# Altium project PHANTOM_VCU.PrjPcb (part 2 of 4)

## Sheet Power_MCU.SchDoc
size A4; DocumentNumber: 3; SheetNumber: 3; SheetTotal: 8
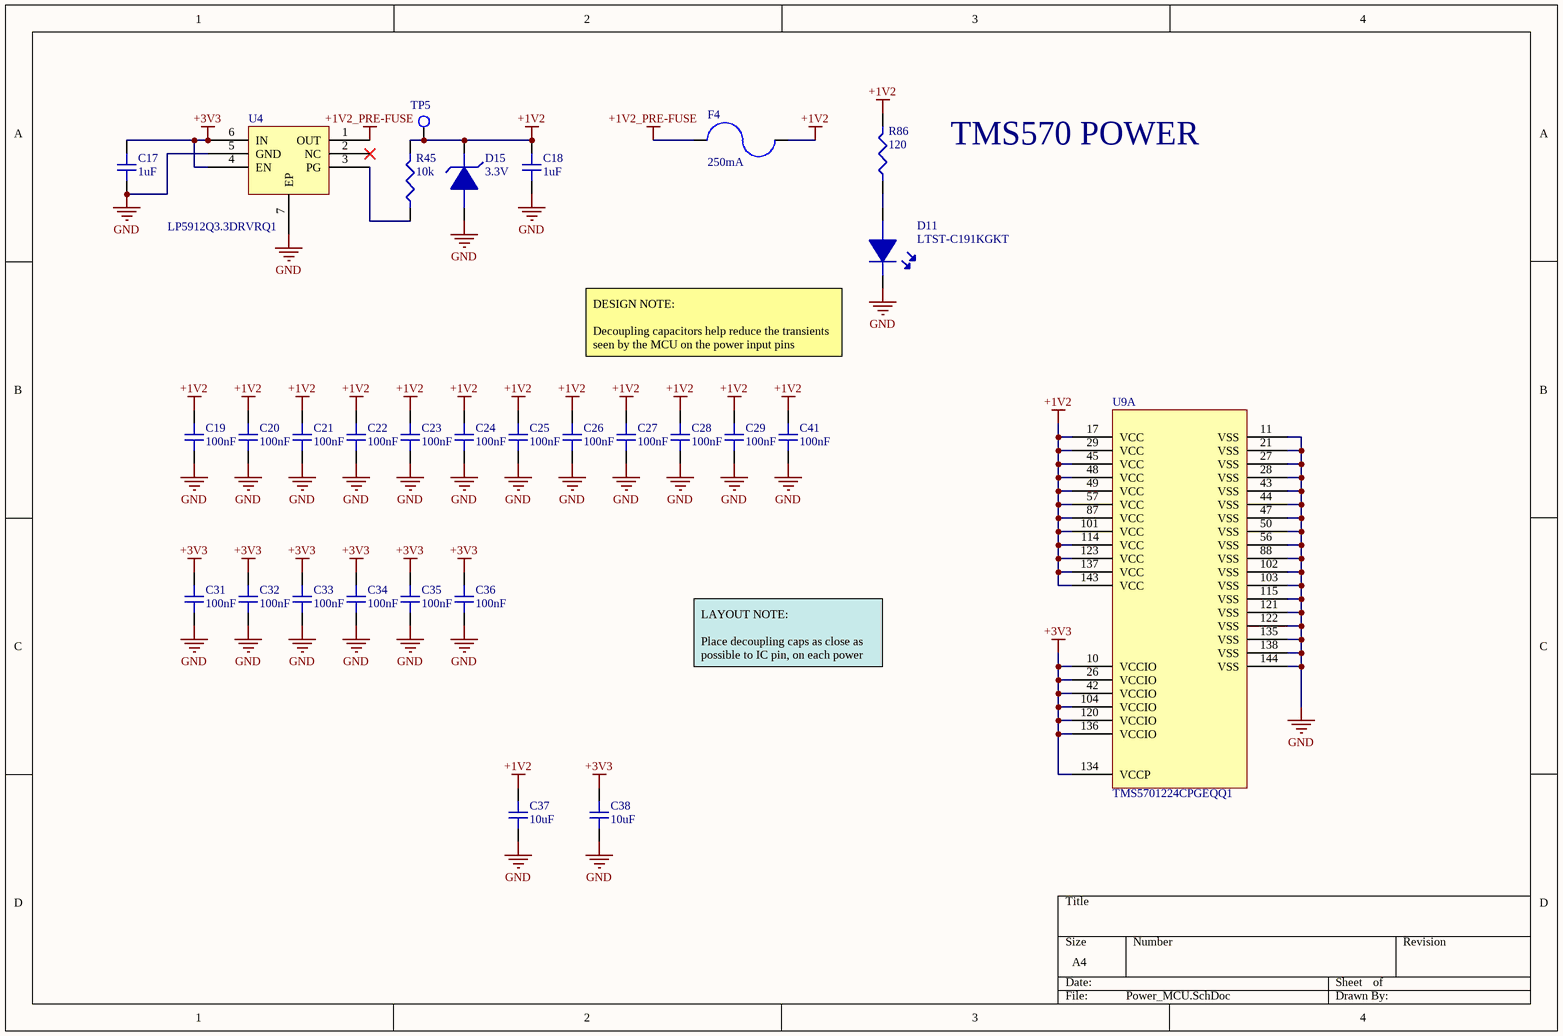
[diagram p2: Power_MCU.SchDoc]

### Parts
C17  1uF  [C0805]
C18  1uF  [C0805]
C19  100nF  [C0805]
C20  100nF  [C0805]
C21  100nF  [C0805]
C22  100nF  [C0805]
C23  100nF  [C0805]
C24  100nF  [C0805]
C25  100nF  [C0805]
C26  100nF  [C0805]
C27  100nF  [C0805]
C28  100nF  [C0805]
C29  100nF  [C0805]
C31  100nF  [C0805]
C32  100nF  [C0805]
C33  100nF  [C0805]
C34  100nF  [C0805]
C35  100nF  [C0805]
C36  100nF  [C0805]
C37  10uF  [TANT_10u]
C38  10uF  [TANT_10u]
C41  100nF  [C0805]
D11  LTST-C191KGKT  [LED_0603]
D15  3.3V  [DIODE_TVS]
F4  250mA  [FUSE_0603]
R45  10k  [R0805]
R86  120  [R0805]
TP5  5015  [TP_HOOK]  (value not drawn)
U4  LP5912Q3.3DRVRQ1  [WSON]
U9  TMS5701224CPGEQQ1  [LQFP-144]  (part A of 3)

### Nets
+1V2: C18.2 C19.2 C20.2 C21.2 C22.2 C23.2 C24.2 C25.2 C26.2 C27.2 C28.2 C29.2 C37.1 C41.2 D15.1 F4.2 R45.2 R86.2 TP5.1 U9.17(VCC) U9.29(VCC) U9.45(VCC) U9.48(VCC) U9.49(VCC) U9.57(VCC) U9.87(VCC) U9.101(VCC) U9.114(VCC) U9.123(VCC) U9.137(VCC) U9.143(VCC)
+1V2_PRE-FUSE: F4.1 U4.1(OUT)
+3V3: C17.2 C31.2 C32.2 C33.2 C34.2 C35.2 C36.2 C38.1 U4.4(EN) U4.6(IN) U9.10(VCCIO) U9.26(VCCIO) U9.42(VCCIO) U9.104(VCCIO) U9.120(VCCIO) U9.134(VCCP) U9.136(VCCIO)
GND: C17.1 C18.1 C19.1 C20.1 C21.1 C22.1 C23.1 C24.1 C25.1 C26.1 C27.1 C28.1 C29.1 C31.1 C32.1 C33.1 C34.1 C35.1 C36.1 C37.2 C38.2 C41.1 D11.2 D15.2 U4.5(GND) U4.7(EP) U9.11(VSS) U9.21(VSS) U9.27(VSS) U9.28(VSS) U9.43(VSS) U9.44(VSS) U9.47(VSS) U9.50(VSS) U9.56(VSS) U9.88(VSS) U9.102(VSS) U9.103(VSS) U9.115(VSS) U9.121(VSS) U9.122(VSS) U9.135(VSS) U9.138(VSS) U9.144(VSS)
NetD11_1: D11.1 R86.1
NetR45_1: R45.1 U4.3(PG)

Not connected (* = marked no-connect by the designer): U4 2(NC)*

### Notes on the sheet
- TMS570 POWER
- DESIGN NOTE:
  Decoupling capacitors help reduce the transients seen by the MCU on the power input pins
- LAYOUT NOTE:
  Place decoupling caps as close as possible to IC pin, on each power pin

### Library data of the parts
C17 C18 = 0805ZC105KAT2A: CAP CER 1UF 10V X7R 0805; Manufacturer: Kyocera AVX; Tolerance: 10%; Dissipation Factor: 5%; Insulation Resistance: 100GR; Supplier 1: Digi-Key; Manufacturer Part Number: 0805ZC105KAT2A; Stock 1: 385183; Pricing 1: 1=0.21, 10=0.147, 100=0.069, 500=0.0484, 1000=0.0401 (USD); Mount: Surface Mount,PCB; Case/Package: 0805; Number of Pins: 2; Case Code (Imperial): 0805; Case Code (Metric): 2012; Contact Plating: Tin,Matte; Min Operating Temperature: -55°C; Max Operating Temperature: 125°C; Capacitance: 1uF; Voltage Rating: 10V; Voltage Rating (DC): 10V; Packaging: Tape and Reel; Package Quantity: 1; Dielectric: X7R; Termination: SMD/SMT; Voltage: 10V; Length: 2.01mm; Height: 1.4mm; Width: 1.25mm; Thickness: 0.055inch; Depth: 1.25mm; Radiation Hardening: No; REACH SVHC: No SVHC; Lead Free: Lead Free; ComponentLink1URL: https://datasheet.ciiva.com/2988/cx7r-2988071.pdf; ComponentLink1Description: https://datasheet.ciiva.com/2988/cx7r-2988071.pdf; ComponentLink2URL: https://datasheet.ciiva.com/2988/cx7r-2988072.pdf; ComponentLink2Description: https://datasheet.ciiva.com/2988/cx7r-2988072.pdf; ComponentLink3URL: https://datasheet.ciiva.com/14601/70001075-14601048.pdf; ComponentLink3Description: https://datasheet.ciiva.com/14601/70001075-14601048.pdf; ComponentLink4URL: https://datasheet.ciiva.com/14594/70001075-14594329.pdf; ComponentLink4Description: https://datasheet.ciiva.com/14594/70001075-14594329.pdf; ComponentLink5URL: https://datasheet.ciiva.com/25901/cx7r-25901193.pdf; ComponentLink5Description: https://datasheet.ciiva.com/25901/cx7r-25901193.pdf; ComponentLink6URL: https://datasheet.ciiva.com/15165/getdatasheetpartid-71567-15165451.pdf; ComponentLink6Description: https://datasheet.ciiva.com/15165/getdatasheetpartid-71567-15165451.pdf; ComponentLink7URL: https://datasheet.ciiva.com/151/cx7r-151916.pdf; ComponentLink7Description: https://datasheet.ciiva.com/151/cx7r-151916.pdf; ComponentLink8URL: https://datasheet.ciiva.com/151/cx7r-151917.pdf; ComponentLink8Description: https://datasheet.ciiva.com/151/cx7r-151917.pdf; ComponentLink9URL: https://datasheet.ciiva.com/151/cx7r-151918.pdf; ComponentLink9Description: https://datasheet.ciiva.com/151/cx7r-151918.pdf; ComponentLink10URL: https://datasheet.ciiva.com/11787/0900766b80ed4be2-11787102.pdf; ComponentLink10Description: https://datasheet.ciiva.com/11787/0900766b80ed4be2-11787102.pdf; ComponentLink11URL: https://datasheet.ciiva.com/7812/84526-7812223.pdf; ComponentLink11Description: https://datasheet.ciiva.com/7812/84526-7812223.pdf; ComponentLink12URL: https://datasheet.ciiva.com/19475/2011248-19475855.pdf; ComponentLink12Description: https://datasheet.ciiva.com/19475/2011248-19475855.pdf; Supplier Part Number 1: 478-1405-1-ND
C19-C29 C31-C36 C41 = GRM21B7U1A104JA01L: CAP MLCC 100nF 10Volts U2J 5%; Manufacturer: Murata; Voltage Rating: 10V; Supplier 1: Digi-Key; Manufacturer Part Number: GRM21B7U1A104JA01L; Stock 1: 6000; Pricing 1: 1=0.46, 10=0.32, 100=0.192, 500=0.144, 1000=0.1216 (USD); Mount: Surface Mount; Case/Package: 0805; Case Code (Imperial): 0805; Case Code (Metric): 2012; Min Operating Temperature: -55°C; Max Operating Temperature: 125°C; Capacitance: 100nF; Voltage Rating (DC): 10V; Tolerance: 5%; Packaging: Tape and Reel; Package Quantity: 3000; Dielectric: U2J; Termination: SMD/SMT; Length: 2mm; Height: 1.25mm; Width: 0.049inch; Thickness: 0.053inch; Depth: 1.25mm; Radiation Hardening: No; ComponentLink1URL: https://datasheet.ciiva.com/5424/product-5424660.pdf; ComponentLink1Description: https://datasheet.ciiva.com/5424/product-5424660.pdf; ComponentLink2URL: https://datasheet.ciiva.com/17451/product-17451845.pdf; ComponentLink2Description: https://datasheet.ciiva.com/17451/product-17451845.pdf; ComponentLink3URL: https://datasheet.ciiva.com/11618/product-11618924.pdf; ComponentLink3Description: https://datasheet.ciiva.com/11618/product-11618924.pdf; Supplier Part Number 1: 490-11592-6-ND
C37 C38 = F381A106MMA: CAP TANTALUM 10uF, 0603 [1608 Metric], 0.5 ohm, 10 V AVX  Surface Mount Tantalum Capacitor, F38 Series, 10uF, 0603 [1608 Metric], 0.5 ohm, 10 V; Manufacturer: Kyocera AVX; Tolerance: 20%; ESR (Equivalent Series Resistance): 500mR; Voltage Rating: 10V; Life (Hours): 1000Hour; Dissipation Factor: 15%; Leakage Current: 10uA; Supplier 1: Digi-Key; Manufacturer Part Number: F381A106MMA; Stock 1: 7989; Pricing 1: 1=0.75, 10=0.551, 100=0.3779, 500=0.2992, 1000=0.2519 (USD); Case/Package: 0603; Weight: 7.1E-05oz; Case Code (Metric): 1608; Case Code (Imperial): 0603; Min Operating Temperature: -55°C; Max Operating Temperature: 105°C; Capacitance: 10uF; Packaging: Tape and Reel; Termination: SMD/SMT; Package Quantity: 4000; Voltage Rating (DC): 10V; Length: 1.6mm; Height: 0.8mm; Width: 0.033inch; Height - Seated (Max): 0.035inch; Depth: 0.85mm; Radiation Hardening: No; REACH SVHC: No SVHC; ComponentLink1URL: https://datasheet.ciiva.com/48510/f38-48510901.pdf; ComponentLink1Description: https://datasheet.ciiva.com/48510/f38-48510901.pdf; ComponentLink2URL: https://datasheet.ciiva.com/46417/1805432-46417517.pdf; ComponentLink2Description: https://datasheet.ciiva.com/46417/1805432-46417517.pdf; ComponentLink3URL: https://datasheet.ciiva.com/46417/1805432-46417518.pdf; ComponentLink3Description: https://datasheet.ciiva.com/46417/1805432-46417518.pdf; Supplier Part Number 1: 478-9527-1-ND
D11 = LTST-C191KGKT: LED GREEN CLEAR 0603 SMD; Manufacturer: Vishay Lite-On; Lens Colour: Clear,Colorless; Power Rating: 75mW; Luminous Intensity: 35mcd; Viewing Angle: 130°; Lens Style: Clear,Diffused,Colorless,Rectangular; Forward Current: 30mA; Forward Voltage: 2V; Dominant Wavelength: 571nm; Test Current: 20mA; Number of Elements: 1; Wavelength: 574nm; Supplier 1: Digi-Key; Manufacturer Part Number: LTST-C191KGKT; Stock 1: 1301664; Pricing 1: 1=0.29, 10=0.211, 25=0.1556, 100=0.1111, 250=0.0756, 500=0.0667, 1000=0.0522, 2500=0.0511 (USD); Mount: Surface Mount; Case/Package: 0603; Number of Pins: 2; Colour: Green; Case Code (Metric): 1608; Case Code (Imperial): 0603; Min Operating Temperature: -55°C; Max Operating Temperature: 85°C; Packaging: Tape and Reel; Package Quantity: 1; Illumination Colour: Green; Lens Transparency: Clear; Power Dissipation: 75mW; Number of LEDs: 1; Length: 1.6mm; Height: 0.55mm; Width: 0.8mm; Depth: 0.8mm; Radiation Hardening: No; Lead Free: Lead Free; ComponentLink1URL: https://datasheet.ciiva.com/12400/100-ltst-c191kgkt-53586-12400818.pdf; ComponentLink1Description: https://datasheet.ciiva.com/12400/100-ltst-c191kgkt-53586-12400818.pdf; ComponentLink2URL: https://datasheet.ciiva.com/2109/s-110-ltst-c191kgkt-2109973.pdf; ComponentLink2Description: https://datasheet.ciiva.com/2109/s-110-ltst-c191kgkt-2109973.pdf; ComponentLink3URL: https://datasheet.ciiva.com/2109/s-110-ltst-c191kgkt-2109974.pdf; ComponentLink3Description: https://datasheet.ciiva.com/2109/s-110-ltst-c191kgkt-2109974.pdf; ComponentLink4URL: https://datasheet.ciiva.com/2109/s-110-ltst-c191kgkt-2109975.pdf; ComponentLink4Description: https://datasheet.ciiva.com/2109/s-110-ltst-c191kgkt-2109975.pdf; ComponentLink5URL: https://datasheet.ciiva.com/15223/getdatasheetpartid-103913-15223276.pdf; ComponentLink5Description: https://datasheet.ciiva.com/15223/getdatasheetpartid-103913-15223276.pdf; ComponentLink6URL: https://datasheet.ciiva.com/11773/0900766b80dc02b1-11773629.pdf; ComponentLink6Description: https://datasheet.ciiva.com/11773/0900766b80dc02b1-11773629.pdf; ComponentLink7URL: https://datasheet.ciiva.com/16215/ltst-c191kgkt-16215151.pdf; ComponentLink7Description: https://datasheet.ciiva.com/16215/ltst-c191kgkt-16215151.pdf; Supplier Part Number 1: 160-1446-6-ND
D15 = 1SMA5913BT3G: DIODE ZENER 3.3V 1.5W SMA; Manufacturer: ON Semiconductor; Material: Plastic; Forward Voltage: 1.5V; Tolerance: 5%; Impedance: 10R; Max Reverse Leakage Current: 50uA; Power Dissipation: 500mW; Zener Current: 455mA; Test Current: 113.6mA; Element Configuration: Single; Breakdown Voltage: 3.47V; Supplier 1: Digi-Key; Manufacturer Part Number: 1SMA5913BT3G; Stock 1: 12228; Pricing 1: 1=0.38, 10=0.305, 100=0.2076, 500=0.1557, 1000=0.1168 (USD); Case/Package: SMA; Number of Pins: 2; Min Operating Temperature: -65°C; Max Operating Temperature: 150°C; Max Power Dissipation: 1.5W; Package Quantity: 1; Packaging: Tape and Reel; Zener Voltage: 3.3V; Voltage Tolerance: 5%; Working Voltage: 3.3V; Peak Reverse Current: 50uA; Voltage Rating (DC): 3.3V; Power Rating: 1.5W; Length: 4.57mm; Height: 2.05mm; Width: 2.92mm; Radiation Hardening: No; REACH SVHC: No SVHC; Lead Free: Lead Free; Halogen Free: Halogen Free; ComponentLink1URL: https://datasheet.ciiva.com/8026/1sma5913bt3-d-8026917.pdf; ComponentLink1Description: https://datasheet.ciiva.com/8026/1sma5913bt3-d-8026917.pdf; ComponentLink2URL: https://datasheet.ciiva.com/8345/1sma5913bt3-d-8345864.pdf; ComponentLink2Description: https://datasheet.ciiva.com/8345/1sma5913bt3-d-8345864.pdf; ComponentLink3URL: https://datasheet.ciiva.com/8346/1sma5913bt3-d-8346488.pdf; ComponentLink3Description: https://datasheet.ciiva.com/8346/1sma5913bt3-d-8346488.pdf; ComponentLink4URL: https://datasheet.ciiva.com/895/1sma5913bt3-d-895306.pdf; ComponentLink4Description: https://datasheet.ciiva.com/895/1sma5913bt3-d-895306.pdf; ComponentLink5URL: https://datasheet.ciiva.com/15142/getdatasheetpartid-90498-15142554.pdf; ComponentLink5Description: https://datasheet.ciiva.com/15142/getdatasheetpartid-90498-15142554.pdf; ComponentLink6URL: https://datasheet.ciiva.com/895/1sma5913bt3-d-895307.pdf; ComponentLink6Description: https://datasheet.ciiva.com/895/1sma5913bt3-d-895307.pdf; ComponentLink7URL: https://datasheet.ciiva.com/4733/1sma5913bt3-d-4733195.pdf; ComponentLink7Description: https://datasheet.ciiva.com/4733/1sma5913bt3-d-4733195.pdf; ComponentLink8URL: https://datasheet.ciiva.com/895/1sma5913bt3-d-895308.pdf; ComponentLink8Description: https://datasheet.ciiva.com/895/1sma5913bt3-d-895308.pdf; ComponentLink9URL: https://datasheet.ciiva.com/16472/1sma5913bt3-d-16472764.pdf; ComponentLink9Description: https://datasheet.ciiva.com/16472/1sma5913bt3-d-16472764.pdf; ComponentLink10URL: https://datasheet.ciiva.com/49027/70339279-49027772.pdf; ComponentLink10Description: https://datasheet.ciiva.com/49027/70339279-49027772.pdf; ComponentLink11URL: https://datasheet.ciiva.com/8026/1sma5913bt3-d-8026989.pdf; ComponentLink11Description: https://datasheet.ciiva.com/8026/1sma5913bt3-d-8026989.pdf; ComponentLink12URL: https://datasheet.ciiva.com/8026/1sma5913bt3-d-8026990.pdf; ComponentLink12Description: https://datasheet.ciiva.com/8026/1sma5913bt3-d-8026990.pdf; ComponentLink13URL: https://datasheet.ciiva.com/26092/1sma5913bt3-d-26092398.pdf; ComponentLink13Description: https://datasheet.ciiva.com/26092/1sma5913bt3-d-26092398.pdf; Supplier Part Number 1: 1SMA5913BT3GOSCT-ND
F4 = C2Q250: FUSE_0.25A SMD 0603 BOARD MNT 250MA 32VAC 63VDC; Manufacturer: Bel; Voltage Rating (DC): 63V; Voltage Rating (AC): 32V; DC Cold Resistance: 700mR; Power Dissipation: 80mW; Fuse Type: Board Mount (Cartridge Style Excluded); Approvals: CE,cULus,cURus; Supplier 1: Digi-Key; Manufacturer Part Number: C2Q250; Stock 1: 88874; Pricing 1: 1=0.33, 5=0.322, 10=0.308, 50=0.2746, 100=0.2557, 250=0.2273, 500=0.1894, 1000=0.18 (USD); Mount: Surface Mount; Case/Package: 0603; Number of Pins: 2; Case Code (Metric): 1608; Case Code (Imperial): 0603; Contact Plating: Tin; Housing Material: Ceramic; Min Operating Temperature: -55°C; Max Operating Temperature: 125°C; Current Rating: 250mA; Packaging: Tape and Reel; Max Voltage Rating (DC): 63V; Voltage Rating: 32V; Length: 0.063inch; Height: 0.019inch; Width: 0.032inch; Depth: 0.82mm; Lead Free: Lead Free; ComponentLink1URL: https://datasheet.ciiva.com/300/c2q-300599.pdf; ComponentLink1Description: https://datasheet.ciiva.com/300/c2q-300599.pdf; ComponentLink2URL: https://datasheet.ciiva.com/300/c2q-300600.pdf; ComponentLink2Description: https://datasheet.ciiva.com/300/c2q-300600.pdf; ComponentLink3URL: https://datasheet.ciiva.com/300/c2q-300601.pdf; ComponentLink3Description: https://datasheet.ciiva.com/300/c2q-300601.pdf; ComponentLink4URL: https://datasheet.ciiva.com/8264/c2q-8264041.pdf; ComponentLink4Description: https://datasheet.ciiva.com/8264/c2q-8264041.pdf; Supplier Part Number 1: 507-1086-1-ND
R45 = RC0805FR-071KL: RES SMD 10K OHM 1% 1/8W 0805; Manufacturer: Yageo Phycomp; Temperature Coefficient: 100ppm/°C; Resistance: 1KR; Voltage Rating (DC): 150V; Power Rating: 125mW; Supplier 1: Digi-Key; Manufacturer Part Number: RC0805FR-071KL; Stock 1: 5527973; Pricing 1: 1=0.1, 10=0.022, 100=0.0088, 1000=0.004, 2500=0.0034 (USD); Case/Package: 0805; Number of Pins: 2; Min Operating Temperature: -55°C; Max Operating Temperature: 155°C; Tolerance: 1%; Packaging: Cut Tape; Length: 2mm; Height: 0.5mm; Width: 1.25mm; Depth: 1.25mm; REACH SVHC: No SVHC; Lead Free: Lead Free
R86 = RC0805FR-07120RL: RES SMD 120 OHM 1% 1/8W 0805; Manufacturer: Yageo; Resistance: 120R; Power Rating: 125mW; Voltage Rating: 150V; Temperature Coefficient: 100ppm/°C; Supplier 1: Digi-Key; Manufacturer Part Number: RC0805FR-07120RL; Stock 1: 632664; Pricing 1: 1=0.1, 10=0.022, 100=0.0088, 1000=0.004, 2500=0.0034 (USD); Case/Package: 0805; Case Code (Metric): 2012; Case Code (Imperial): 0805; Min Operating Temperature: -55°C; Max Operating Temperature: 155°C; Tolerance: 1%; Package Quantity: 1; Packaging: Tape and Reel; Composition: Thick Film; Number of Terminations: 2; Termination: SMD/SMT; Military Standard: Not; Max Power Dissipation: 125mW; Length: 2mm; Height: 0.5mm; Width: 0.049inch; Depth: 1.25mm; REACH SVHC: Unknown; Lead Free: Lead Free; ComponentLink1URL: https://datasheet.ciiva.com/2491/pyu-r-int-thick-7-2491585.pdf; ComponentLink1Description: https://datasheet.ciiva.com/2491/pyu-r-int-thick-7-2491585.pdf; ComponentLink2URL: https://datasheet.ciiva.com/2491/pyu-r-int-thick-7-2491586.pdf; ComponentLink2Description: https://datasheet.ciiva.com/2491/pyu-r-int-thick-7-2491586.pdf; ComponentLink3URL: https://datasheet.ciiva.com/2491/pyu-r-int-thick-7-2491587.pdf; ComponentLink3Description: https://datasheet.ciiva.com/2491/pyu-r-int-thick-7-2491587.pdf; ComponentLink4URL: https://datasheet.ciiva.com/12558/rc0805-257173-12558661.pdf; ComponentLink4Description: https://datasheet.ciiva.com/12558/rc0805-257173-12558661.pdf; ComponentLink5URL: https://datasheet.ciiva.com/11819/0900766b8106beab-11819786.pdf; ComponentLink5Description: https://datasheet.ciiva.com/11819/0900766b8106beab-11819786.pdf; ComponentLink6URL: https://datasheet.ciiva.com/7941/444164-7941691.pdf; ComponentLink6Description: https://datasheet.ciiva.com/7941/444164-7941691.pdf; ComponentLink7URL: https://datasheet.ciiva.com/7941/444164-7941692.pdf; ComponentLink7Description: https://datasheet.ciiva.com/7941/444164-7941692.pdf; ComponentLink8URL: https://datasheet.ciiva.com/16964/rc0805-16964606.pdf; ComponentLink8Description: https://datasheet.ciiva.com/16964/rc0805-16964606.pdf; Supplier Part Number 1: 311-120CRCT-ND
TP5 = 5015: TEST POINT, PCB, SMT; Manufacturer: Keystone Electronics; Number of Ports: 1; Supplier 1: Digi-Key; Manufacturer Part Number: 5015; Stock 1: 1937775; Pricing 1: 1=0.44, 10=0.421, 25=0.3604, 50=0.3064, 100=0.2944, 250=0.2644, 500=0.2524 (USD); Mount: Surface Mount; Colour: White; Contact Material: Bronze; Contact Plating: Tin,Silver,Lead; Material: Bronze,Silver; Package Quantity: 1; Packaging: Tape and Reel; Termination: Solder; Orientation: Straight; Length: 2.66mm; Height: 0.06inch; Thickness: 0.01inch; Depth: 1.01mm; REACH SVHC: No SVHC; Lead Free: Lead Free; ComponentLink1URL: https://datasheet.ciiva.com/2917/5015-2917616.pdf; ComponentLink1Description: https://datasheet.ciiva.com/2917/5015-2917616.pdf; ComponentLink2URL: https://datasheet.ciiva.com/2917/5015-2917617.pdf; ComponentLink2Description: https://datasheet.ciiva.com/2917/5015-2917617.pdf; ComponentLink3URL: https://datasheet.ciiva.com/1123/5015-1123862.pdf; ComponentLink3Description: https://datasheet.ciiva.com/1123/5015-1123862.pdf; ComponentLink4URL: https://datasheet.ciiva.com/16883/70182998-16883734.pdf; ComponentLink4Description: https://datasheet.ciiva.com/16883/70182998-16883734.pdf; Supplier Part Number 1: 36-5015CT-ND
U4 = LP5912Q3.3DRVRQ1: LDO_1V2 REG 3.3V INPUT 1V2 OUTPUT 0.5A; Manufacturer: Texas Instruments; Quiescent Current: 30uA; Dropout Voltage: 150mV; Supplier 1: Digi-Key; Manufacturer Part Number: LP5912Q3.3DRVRQ1; Stock 1: 10415; Pricing 1: 1=1.41, 10=1.261, 100=0.9831, 500=0.8122, 1000=0.6412 (USD); Min Operating Temperature: -40°C; Max Operating Temperature: 125°C; Lead Free: Lead Free; ComponentLink1URL: http://www.ti.com/lit/ds/symlink/lp5912-q1.pdf; ComponentLink1Description: http://www.ti.com/lit/ds/symlink/lp5912-q1.pdf; Supplier Part Number 1: 296-44294-1-ND
U9 = TMS5701224CPGEQQ1: ARM CORTEX R4 LOCK STEP HERCULES MCU; Manufacturer: Texas Instruments; Frequency: 160MHz; Interface: I2C,SPI,CAN,UART,USART,LIN,SCI,EBI/EMI; Number of I/Os: 64; Oscillator Type: External; RAM Size: 192KB; Number of Timers/Counters: 2; Watchdog Timer: Yes; Memory Type: FLASH; Memory Size: 1.25MB; Density: 1310720B; Peripherals: POR,PWM,WDT,DMA; Supplier 1: Digi-Key; Manufacturer Part Number: TMS5701224CPGEQQ1; Stock 1: 113; Pricing 1: 1=22.12, 10=20.402, 100=17.4222, 500=15.8176 (USD); Case/Package: LQFP; Number of Pins: 144; Min Operating Temperature: -40°C; Max Operating Temperature: 125°C; Packaging: Tray; Number of Programmable I/O: 64; Max Frequency: 160MHz; Number of GPIO: 64; Core Architecture: ARM; Lead Free: Lead Free; ComponentLink1URL: http://www.ti.com/lit/pdf/spnu515; ComponentLink1Description: http://www.ti.com/lit/pdf/spnu515; ComponentLink2URL: http://www.ti.com/lit/gpn/tms570ls1224; ComponentLink2Description: http://www.ti.com/lit/gpn/tms570ls1224; ComponentLink3URL: http://www.ti.com/general/docs/lit/getliterature.tsp?genericPartNumber=TMS570LS1224&&fileType=pdf; ComponentLink3Description: http://www.ti.com/general/docs/lit/getliterature.tsp?genericPartNumber=TMS570LS1224&&fileType=pdf; Supplier Part Number 1: 296-47200-ND

## Sheet VCU_Schematic.SchDoc
size A4; DocumentNumber: 4; SheetNumber: 4; SheetTotal: 8
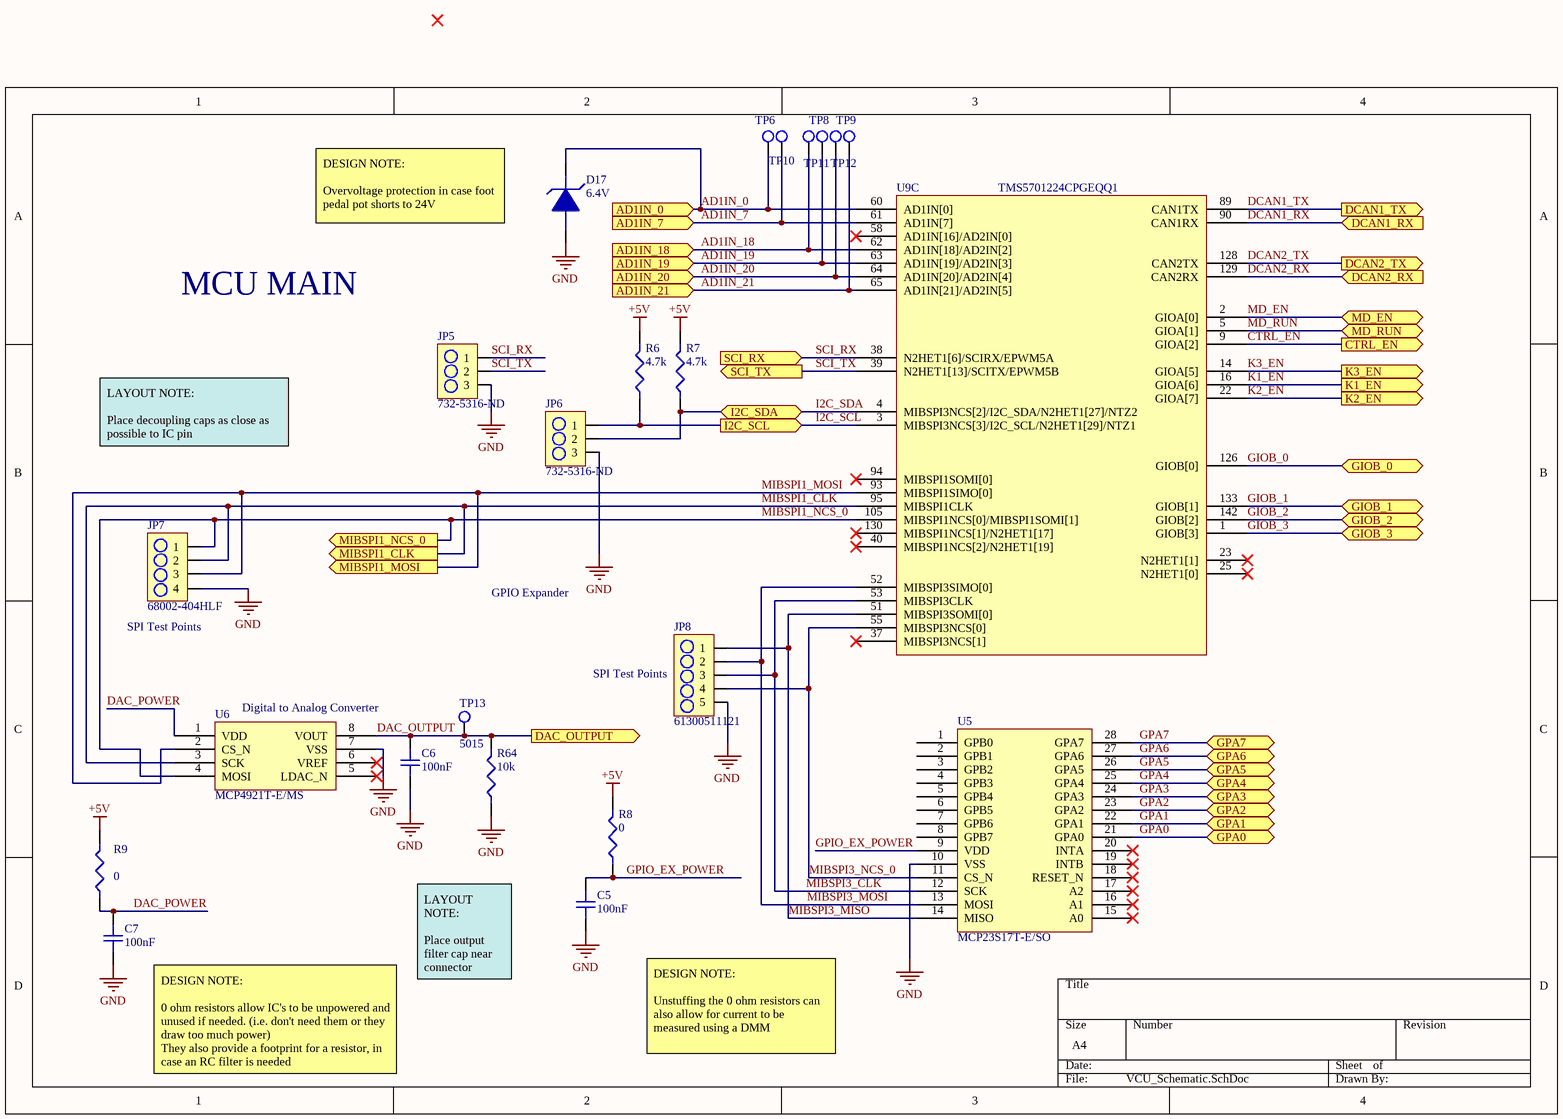
[diagram p3: VCU_Schematic.SchDoc]

### Parts
C5  100nF  [C0805]
C6  100nF  [C0805]
C7  100nF  [C0805]
D17  6.4V  [DIODE_TVS]
JP5  732-5316-ND  [3PIN_HEADER]
JP6  732-5316-ND  [3PIN_HEADER]
JP7  68002-404HLF  [4PIN_HEADER]
JP8  61300511121  [5PIN_HEADER]
R6  4.7k  [R0805]
R7  4.7k  [R0805]
R8  0  [R0805]
R9  0  [R0805]
R64  10k  [R0805]
TP6  5015  [TP_HOOK]  (value not drawn)
TP8  5015  [TP_HOOK]  (value not drawn)
TP9  5015  [TP_HOOK]  (value not drawn)
TP10  5015  [TP_HOOK]  (value not drawn)
TP11  5015  [TP_HOOK]  (value not drawn)
TP12  5015  [TP_HOOK]  (value not drawn)
TP13  5015  [TP_HOOK]
U5  MCP23S17T-E/SO  [28-SOIC_MCP23S17]
U6  MCP4921T-E/MS  [8-MSOP_MCP4921]
U9  TMS5701224CPGEQQ1  [LQFP-144]  (part C of 3)

### Ports
AD1IN_0, AD1IN_7, AD1IN_18, AD1IN_19, AD1IN_20, AD1IN_21, CTRL_EN, DAC_OUTPUT, DCAN1_RX, DCAN1_TX, DCAN2_RX, DCAN2_TX, GIOB_0, GIOB_1, GIOB_2, GIOB_3, GPA0, GPA1, GPA2, GPA3, GPA4, GPA5, GPA6, GPA7, I2C_SCL, I2C_SDA, K1_EN, K2_EN, K3_EN, MD_EN, MD_RUN, MIBSPI1_CLK, MIBSPI1_MOSI, MIBSPI1_NCS_0, SCI_RX, SCI_TX

### Nets
+5V: R6.2 R7.2 R8.2 R9.2
GND: C5.1 C6.1 C7.1 D17.2 JP5.3 JP6.3 JP7.4 JP8.5 R64.1 U5.10(VSS) U6.7(VSS)
AD1IN_0: D17.1 TP6.1 U9.60(AD1IN[0]) ; port AD1IN_0
AD1IN_7: TP10.1 U9.61(AD1IN[7]) ; port AD1IN_7
AD1IN_18: TP11.1 U9.62(AD1IN[18]/AD2IN[2]) ; port AD1IN_18
AD1IN_19: TP8.1 U9.63(AD1IN[19]/AD2IN[3]) ; port AD1IN_19
AD1IN_20: TP12.1 U9.64(AD1IN[20]/AD2IN[4]) ; port AD1IN_20
AD1IN_21: TP9.1 U9.65(AD1IN[21]/AD2IN[5]) ; port AD1IN_21
CTRL_EN: U9.9(GIOA[2]) ; port CTRL_EN
DAC_OUTPUT: C6.2 R64.2 TP13.1 U6.8(VOUT) ; port DAC_OUTPUT
DAC_POWER: C7.2 R9.1 U6.1(VDD)
DCAN1_RX: U9.90(CAN1RX) ; port DCAN1_RX
DCAN1_TX: U9.89(CAN1TX) ; port DCAN1_TX
DCAN2_RX: U9.129(CAN2RX) ; port DCAN2_RX
DCAN2_TX: U9.128(CAN2TX) ; port DCAN2_TX
GIOB_0: U9.126(GIOB[0]) ; port GIOB_0
GIOB_1: U9.133(GIOB[1]) ; port GIOB_1
GIOB_2: U9.142(GIOB[2]) ; port GIOB_2
GIOB_3: U9.1(GIOB[3]) ; port GIOB_3
GPA0: U5.21(GPA0) ; port GPA0
GPA1: U5.22(GPA1) ; port GPA1
GPA2: U5.23(GPA2) ; port GPA2
GPA3: U5.24(GPA3) ; port GPA3
GPA4: U5.25(GPA4) ; port GPA4
GPA5: U5.26(GPA5) ; port GPA5
GPA6: U5.27(GPA6) ; port GPA6
GPA7: U5.28(GPA7) ; port GPA7
GPIO_EX_POWER: C5.2 R8.1 U5.9(VDD)
I2C_SCL: JP6.1 R6.1 U9.3(MIBSPI3NCS[3]/I2C_SCL/N2HET1[29]/NTZ1) ; port I2C_SCL
I2C_SDA: JP6.2 R7.1 U9.4(MIBSPI3NCS[2]/I2C_SDA/N2HET1[27]/NTZ2) ; port I2C_SDA
K1_EN: U9.16(GIOA[6]) ; port K1_EN
K2_EN: U9.22(GIOA[7]) ; port K2_EN
K3_EN: U9.14(GIOA[5]) ; port K3_EN
MD_EN: U9.2(GIOA[0]) ; port MD_EN
MD_RUN: U9.5(GIOA[1]) ; port MD_RUN
MIBSPI1_CLK: JP7.2 U6.3(SCK) U9.95(MIBSPI1CLK) ; port MIBSPI1_CLK
MIBSPI1_MOSI: JP7.3 U6.2(CS_N) U9.93(MIBSPI1SIMO[0]) ; port MIBSPI1_MOSI
MIBSPI1_NCS_0: JP7.1 U6.4(MOSI) U9.105(MIBSPI1NCS[0]/MIBSPI1SOMI[1]) ; port MIBSPI1_NCS_0
MIBSPI3_CLK: JP8.3 U5.12(SCK) U9.53(MIBSPI3CLK)
MIBSPI3_MISO: JP8.1 U5.14(MISO) U9.51(MIBSPI3SOMI[0])
MIBSPI3_MOSI: JP8.2 U5.13(MOSI) U9.52(MIBSPI3SIMO[0])
MIBSPI3_NCS_0: JP8.4 U5.11(CS_N) U9.55(MIBSPI3NCS[0])
SCI_RX: JP5.1 U9.38(N2HET1[6]/SCIRX/EPWM5A) ; port SCI_RX
SCI_TX: JP5.2 U9.39(N2HET1[13]/SCITX/EPWM5B) ; port SCI_TX

Not connected (* = marked no-connect by the designer): U5 1(GPB0) 2(GPB1) 3(GPB2) 4(GPB3) 5(GPB4) 6(GPB5) 7(GPB6) 8(GPB7) 15(A0)* 16(A1)* 17(A2)* 18(RESET_N)* 19(INTB)* 20(INTA)*; U6 5(LDAC_N)* 6(VREF)*; U9 23(N2HET1[1])* 25(N2HET1[0])* 37(MIBSPI3NCS[1])* 40(MIBSPI1NCS[2]/N2HET1[19])* 58(AD1IN[16]/AD2IN[0])* 94(MIBSPI1SOMI[0])* 130(MIBSPI1NCS[1]/N2HET1[17])*

### Notes on the sheet
- DESIGN NOTE:
  Overvoltage protection in case foot pedal pot shorts to 24V
- MCU MAIN
- LAYOUT NOTE:
  Place decoupling caps as close as possible to IC pin
- GPIO Expander
- (near JP7) SPI Test Points
- Digital to Analog Converter
- (near JP8) SPI Test Points
- LAYOUT NOTE:
  Place output filter cap near connector
- (near C7) DESIGN NOTE:
  0 ohm resistors allow IC's to be unpowered and unused if needed. (i.e. don't need them or they draw too much power)
  They also provide a footprint for a resistor, in case an RC filter is needed
- DESIGN NOTE:
  Unstuffing the 0 ohm resistors can also allow for current to be measured using a DMM

### Library data of the parts
C5-C7 = GRM21B7U1A104JA01L: as C19 on sheet Power_MCU; Supplier 1: Digi-Key; Manufacturer Part Number: GRM21B7U1A104JA01L; Stock 1: 6000; Pricing 1: 1=0.46, 10=0.32, 100=0.192, 500=0.144, 1000=0.1216 (USD); Mount: Surface Mount; Case/Package: 0805; Case Code (Imperial): 0805; Case Code (Metric): 2012; Min Operating Temperature: -55°C; Max Operating Temperature: 125°C; Capacitance: 100nF; Voltage Rating (DC): 10V; Tolerance: 5%; Packaging: Tape and Reel; Package Quantity: 3000; Dielectric: U2J; Termination: SMD/SMT; Length: 2mm; Height: 1.25mm; Width: 0.049inch; Thickness: 0.053inch; Depth: 1.25mm; Radiation Hardening: No; ComponentLink1URL: https://datasheet.ciiva.com/5424/product-5424660.pdf; ComponentLink1Description: https://datasheet.ciiva.com/5424/product-5424660.pdf; ComponentLink2URL: https://datasheet.ciiva.com/17451/product-17451845.pdf; ComponentLink2Description: https://datasheet.ciiva.com/17451/product-17451845.pdf; ComponentLink3URL: https://datasheet.ciiva.com/11618/product-11618924.pdf; ComponentLink3Description: https://datasheet.ciiva.com/11618/product-11618924.pdf; Supplier Part Number 1: 490-11592-6-ND
D17 = SMAJ5.0A: DIODE TVS_6V4 5VWM 9.2VC SMA; Manufacturer: Littelfuse; Clamping Voltage: 9.2V; Polarity: Unidirectional; Power Dissipation: 400W; Voltage Rating (DC): 5V; Number of Elements: 1; Max Surge Current: 43.5A; Power Line Protection: No; Test Current: 10mA; Max Breakdown Voltage: 7V; Max Reverse Leakage Current: 800uA; Max Power Dissipation: 3.3W; Element Configuration: Single; Supplier 1: Digi-Key; Manufacturer Part Number: SMAJ5.0A; Stock 1: 78251; Pricing 1: 1=0.51, 10=0.359, 25=0.2948, 100=0.2359, 250=0.1716, 500=0.1394, 1000=0.1072, 2500=0.0965 (USD); Mount: Surface Mount; Number of Pins: 2; Min Operating Temperature: -65°C; Max Operating Temperature: 150°C; Direction: Unidirectional; Package Quantity: 5000; Operating Supply Voltage: 5V; Packaging: Tape and Reel; Reverse Breakdown Voltage: 6.4V; Number of Unidirectional Channels: 1; Reverse Standoff Voltage: 5V; Min Breakdown Voltage: 6.4V; Peak Pulse Power: 400W; Breakdown Voltage: 6.4V; Number of Channels: 1; Termination: SMD/SMT; Peak Pulse Current: 43.5A; Leakage Current: 800uA; Length: 4.5mm; Height: 2.087mm; Width: 2.79mm; Radiation Hardening: No; REACH SVHC: No SVHC; Lead Free: Lead Free; ComponentLink1URL: https://datasheet.ciiva.com/330/littelfuse-tvs-diode-smaj-datasheet-pdf-330724.pdf; ComponentLink1Description: https://datasheet.ciiva.com/330/littelfuse-tvs-diode-smaj-datasheet-pdf-330724.pdf; ComponentLink2URL: https://datasheet.ciiva.com/330/littelfuse-tvs-diode-smaj-datasheet-pdf-330725.pdf; ComponentLink2Description: https://datasheet.ciiva.com/330/littelfuse-tvs-diode-smaj-datasheet-pdf-330725.pdf; ComponentLink3URL: https://datasheet.ciiva.com/330/littelfuse-tvs-diode-smaj-datasheet-pdf-330726.pdf; ComponentLink3Description: https://datasheet.ciiva.com/330/littelfuse-tvs-diode-smaj-datasheet-pdf-330726.pdf; ComponentLink4URL: https://datasheet.ciiva.com/16380/littelfuse-tvs-diode-smaj-16380982.pdf; ComponentLink4Description: https://datasheet.ciiva.com/16380/littelfuse-tvs-diode-smaj-16380982.pdf; ComponentLink5URL: https://datasheet.ciiva.com/25624/0900766b810f4edb-25624839.pdf; ComponentLink5Description: https://datasheet.ciiva.com/25624/0900766b810f4edb-25624839.pdf; ComponentLink6URL: https://datasheet.ciiva.com/28473/607617-28473433.pdf; ComponentLink6Description: https://datasheet.ciiva.com/28473/607617-28473433.pdf; ComponentLink7URL: https://datasheet.ciiva.com/4507/littelfuse-tvs-diode-smaj-23503-4507964.pdf; ComponentLink7Description: https://datasheet.ciiva.com/4507/littelfuse-tvs-diode-smaj-23503-4507964.pdf; ComponentLink8URL: https://datasheet.ciiva.com/8062/littelfuse-tvs-diode-smaj-8062271.pdf; ComponentLink8Description: https://datasheet.ciiva.com/8062/littelfuse-tvs-diode-smaj-8062271.pdf; Supplier Part Number 1: SMAJ5.0ALFCT-ND
JP5 JP6 = 61300311121: CONN_HeaderPins3pos WURTH ELEKTRONIK Board-To-Board Connector, Vertical, WR-PHD Series, Through Hole, Header, 3 Contacts, 2.54 mm; Manufacturer: Wurth Electronics; Number of Positions: 3; Gender: Male; Connector Type: Male Pin; Pitch: 0.1inch; Supplier 1: Digi-Key; Manufacturer Part Number: 61300311121; Stock 1: 57026; Pricing 1: 1=0.13, 10=0.106, 25=0.088, 50=0.074, 100=0.067, 1000=0.061 (USD); Mount: Through Hole; Case/Package: 100; Contact Plating: Gold; Contact Material: Copper; Colour: Black; Number of Rows: 1; Packaging: Bulk; Termination: Solder; Number of Contacts: 3; Contact Mating Length: 0.236inch; REACH SVHC: Unknown; Lead Free: Lead Free; ComponentLink1URL: http://www.farnell.com/cad/1737268.pdf; ComponentLink1Description: http://www.farnell.com/cad/1737268.pdf; Supplier Part Number 1: 732-5316-ND
JP7 = 68002-404HLF: CONN_HeaderPins4pos 4 Positions Header, Unshrouded Connector 0.100" (2.54mm) Through Hole Tin; Manufacturer: Amphenol FCI; Number of Positions: 4; Max Voltage Rating (AC): 1.5kV; Gender: Male; Connector Type: Male Pin; Current Rating: 3A; Insulation Resistance: 5GR; Mating Post Length: 5.84mm; Supplier 1: Digi-Key; Manufacturer Part Number: 68002-404HLF; Stock 1: 4956; Pricing 1: 1=0.21, 10=0.195, 100=0.1352, 500=0.1144, 1000=0.0936, 5000=0.0832, 10000=0.0754 (USD); Mount: Through Hole; Contact Plating: Nickel,Tin; Contact Material: Bronze; Colour: Black; Housing Colour: Black; Housing Material: Thermoplastic; Min Operating Temperature: -65°C; Max Operating Temperature: 125°C; Number of Rows: 1; Packaging: Bulk; Package Quantity: 100; Termination: Solder; Number of Contacts: 4; Orientation: Straight; Voltage Rating: 1.5kV; Contact Gender: Male; Length: 10.16mm; Pitch: 2.54mm; Depth: 2.41mm; Contact Mating Length: 0.23inch; Termination Post Length: 3.81mm; Radiation Hardening: No; Flammability Rating: UL94 V-0; ComponentLink1URL: https://datasheet.ciiva.com/9474/68000-9474358.pdf; ComponentLink1Description: https://datasheet.ciiva.com/9474/68000-9474358.pdf; ComponentLink2URL: https://datasheet.ciiva.com/16725/68000-16725993.pdf; ComponentLink2Description: https://datasheet.ciiva.com/16725/68000-16725993.pdf; ComponentLink3URL: https://datasheet.ciiva.com/728/68000-728877.pdf; ComponentLink3Description: https://datasheet.ciiva.com/728/68000-728877.pdf; Supplier Part Number 1: 609-3305-ND
JP8 = 61300511121: CONN_HeaderPins5pos WURTH ELEKTRONIK         61300511121            Board-To-Board Connector, Vertical, WR-PHD Series, Through Hole, Header, 5 Contacts, 2.54 mm; Manufacturer: Wurth Electronics; Number of Positions: 5; Gender: Male; Connector Type: Male Pin; Pitch: 0.1inch; Supplier 1: Digi-Key; Manufacturer Part Number: 61300511121; Stock 1: 13004; Pricing 1: 1=0.25, 10=0.209, 25=0.174, 50=0.145, 100=0.132, 1000=0.12 (USD); Mount: Through Hole; Contact Plating: Gold; Contact Material: Copper; Colour: Black; Number of Rows: 1; Packaging: Bulk; Termination: Solder; Number of Contacts: 5; Contact Mating Length: 0.236inch; REACH SVHC: Unknown; Lead Free: Lead Free; ComponentLink1URL: http://www.farnell.com/cad/1737268.pdf; ComponentLink1Description: http://www.farnell.com/cad/1737268.pdf; Supplier Part Number 1: 732-5318-ND
R6 R7 = RC0805FR-074K7L: RES SMD 4.7K OHM 1% 1/8W 0805; Manufacturer: Yageo; Resistance: 4.7KR; Temperature Coefficient: 100ppm/°C; Power Rating: 125mW; Voltage Rating: 150V; Supplier 1: Digi-Key; Manufacturer Part Number: RC0805FR-074K7L; Stock 1: 2632902; Pricing 1: 1=0.1, 10=0.022, 100=0.0088, 1000=0.004, 2500=0.0034 (USD); Case/Package: 0805; Number of Pins: 2; Case Code (Metric): 2012; Case Code (Imperial): 0805; Min Operating Temperature: -55°C; Max Operating Temperature: 155°C; Packaging: Tape and Reel; Tolerance: 1%; Composition: Thick Film; Voltage Rating (DC): 150V; Termination: SMD/SMT; Military Standard: Not; Package Quantity: 5000; Number of Terminations: 2; Max Power Dissipation: 125mW; Length: 0.079inch; Height: 0.024inch; Width: 0.049inch; Depth: 1.25mm; REACH SVHC: No SVHC; Lead Free: Lead Free; ComponentLink1URL: https://datasheet.ciiva.com/11808/0900766b8106beab-11808155.pdf; ComponentLink1Description: https://datasheet.ciiva.com/11808/0900766b8106beab-11808155.pdf; ComponentLink2URL: https://datasheet.ciiva.com/7941/444164-7941804.pdf; ComponentLink2Description: https://datasheet.ciiva.com/7941/444164-7941804.pdf; ComponentLink3URL: https://datasheet.ciiva.com/7941/1686128-7941805.pdf; ComponentLink3Description: https://datasheet.ciiva.com/7941/1686128-7941805.pdf; ComponentLink4URL: https://datasheet.ciiva.com/7941/444164-7941806.pdf; ComponentLink4Description: https://datasheet.ciiva.com/7941/444164-7941806.pdf; ComponentLink5URL: https://datasheet.ciiva.com/6547/pyu-r-int-thick-7-6547263.pdf; ComponentLink5Description: https://datasheet.ciiva.com/6547/pyu-r-int-thick-7-6547263.pdf; ComponentLink6URL: https://datasheet.ciiva.com/46447/444164-46447583.pdf; ComponentLink6Description: https://datasheet.ciiva.com/46447/444164-46447583.pdf; Supplier Part Number 1: 311-4.70KCRDKR-ND
R8 R9 = RC0805JR-070RL: RES SMD 0 OHM 1/8W 0805; Manufacturer: Yageo; Resistance: 0mR; Tolerance: 5%; Voltage Rating: 150V; Power Rating: 125mW; Temperature Coefficient: 200ppm/°C; Supplier 1: Digi-Key; Manufacturer Part Number: RC0805JR-070RL; Stock 1: 5922085; Pricing 1: 1=0.1, 10=0.018, 25=0.0128, 50=0.0096, 100=0.0071, 250=0.0054, 500=0.0044, 1000=0.0032 (USD); Case/Package: 0805; Number of Pins: 2; Case Code (Imperial): 0805; Case Code (Metric): 2012; Contact Plating: Tin,Matte; Min Operating Temperature: -55°C; Max Operating Temperature: 155°C; Packaging: Tape and Reel; Voltage Rating (DC): 150V; Termination: SMD/SMT; Composition: Thick Film; Military Standard: Not; Length: 2mm; Height: 0.5mm; Width: 1.25mm; Depth: 1.25mm; Radiation Hardening: No; REACH SVHC: Unknown; Lead Free: Lead Free; ComponentLink1URL: https://datasheet.ciiva.com/7941/1738694-7941861.pdf; ComponentLink1Description: https://datasheet.ciiva.com/7941/1738694-7941861.pdf; ComponentLink2URL: https://datasheet.ciiva.com/7941/1738694-7941862.pdf; ComponentLink2Description: https://datasheet.ciiva.com/7941/1738694-7941862.pdf; ComponentLink3URL: https://datasheet.ciiva.com/11819/0900766b8106beab-11819430.pdf; ComponentLink3Description: https://datasheet.ciiva.com/11819/0900766b8106beab-11819430.pdf; ComponentLink4URL: https://datasheet.ciiva.com/7941/1738694-7941863.pdf; ComponentLink4Description: https://datasheet.ciiva.com/7941/1738694-7941863.pdf; ComponentLink5URL: https://datasheet.ciiva.com/15190/getdatasheetpartid-330685-15190028.pdf; ComponentLink5Description: https://datasheet.ciiva.com/15190/getdatasheetpartid-330685-15190028.pdf; Supplier Part Number 1: 311-0.0ARDKR-ND
R64 = RC0805FR-071KL: as R45 on sheet Power_MCU; Supplier 1: Digi-Key; Manufacturer Part Number: RC0805FR-071KL; Stock 1: 5527973; Pricing 1: 1=0.1, 10=0.022, 100=0.0088, 1000=0.004, 2500=0.0034 (USD); Case/Package: 0805; Number of Pins: 2; Min Operating Temperature: -55°C; Max Operating Temperature: 155°C; Tolerance: 1%; Packaging: Cut Tape; Length: 2mm; Height: 0.5mm; Width: 1.25mm; Depth: 1.25mm; REACH SVHC: No SVHC; Lead Free: Lead Free
TP6 TP8-TP13 = 5015: as TP5 on sheet Power_MCU; Supplier 1: Digi-Key; Manufacturer Part Number: 5015; Stock 1: 1937775; Pricing 1: 1=0.44, 10=0.421, 25=0.3604, 50=0.3064, 100=0.2944, 250=0.2644, 500=0.2524 (USD); Mount: Surface Mount; Colour: White; Contact Material: Bronze; Contact Plating: Tin,Silver,Lead; Material: Bronze,Silver; Package Quantity: 1; Packaging: Tape and Reel; Termination: Solder; Orientation: Straight; Length: 2.66mm; Height: 0.06inch; Thickness: 0.01inch; Depth: 1.01mm; REACH SVHC: No SVHC; Lead Free: Lead Free; ComponentLink1URL: https://datasheet.ciiva.com/2917/5015-2917616.pdf; ComponentLink1Description: https://datasheet.ciiva.com/2917/5015-2917616.pdf; ComponentLink2URL: https://datasheet.ciiva.com/2917/5015-2917617.pdf; ComponentLink2Description: https://datasheet.ciiva.com/2917/5015-2917617.pdf; ComponentLink3URL: https://datasheet.ciiva.com/1123/5015-1123862.pdf; ComponentLink3Description: https://datasheet.ciiva.com/1123/5015-1123862.pdf; ComponentLink4URL: https://datasheet.ciiva.com/16883/70182998-16883734.pdf; ComponentLink4Description: https://datasheet.ciiva.com/16883/70182998-16883734.pdf; Supplier Part Number 1: 36-5015CT-ND
U5 = MCP23S17T-E/SO: IC I/O Expander, 16bit, 10 MHz, SPI, 4.5 V, 5.5 V, SOIC; Manufacturer: Microchip; Interface: SPI,Serial; Min Supply Voltage: 4.5V; Max Supply Voltage: 5.5V; Number of Channels: 1; Nominal Supply Current: 1mA; Number of I/Os: 16; Power Dissipation: 700mW; Frequency: 10MHz; Supplier 1: Digi-Key; Manufacturer Part Number: MCP23S17T-E/SO; Stock 1: 6929; Pricing 1: 1=1.32, 25=1.1024, 100=0.9975 (USD); Mount: Surface Mount; Case/Package: SOIC; Number of Pins: 28; Min Operating Temperature: -40°C; Max Operating Temperature: 125°C; Packaging: Tape and Reel; Package Quantity: 1600; Max Frequency: 10MHz; Number of Bits: 16; REACH SVHC: No SVHC; Lead Free: Lead Free; ComponentLink1URL: https://datasheet.ciiva.com/1780/21952b-1780739.pdf; ComponentLink1Description: https://datasheet.ciiva.com/1780/21952b-1780739.pdf; ComponentLink2URL: https://datasheet.ciiva.com/1495/12179-1495927.pdf; ComponentLink2Description: https://datasheet.ciiva.com/1495/12179-1495927.pdf; ComponentLink3URL: https://datasheet.ciiva.com/16221/filehandler-aspxddocname-en023709-16221082.pdf; ComponentLink3Description: https://datasheet.ciiva.com/16221/filehandler-aspxddocname-en023709-16221082.pdf; ComponentLink4URL: https://datasheet.ciiva.com/16617/21952b-16617644.pdf; ComponentLink4Description: https://datasheet.ciiva.com/16617/21952b-16617644.pdf; ComponentLink5URL: https://datasheet.ciiva.com/1505/21952b-1505037.pdf; ComponentLink5Description: https://datasheet.ciiva.com/1505/21952b-1505037.pdf; ComponentLink6URL: https://datasheet.ciiva.com/12266/21952b-12266927.pdf; ComponentLink6Description: https://datasheet.ciiva.com/12266/21952b-12266927.pdf; Supplier Part Number 1: MCP23S17T-E/SODKR-ND
U6 = MCP4921T-E/MS: IC Digital to Analog Converters - DAC Sgl 12-bit SPI int; Manufacturer: Microchip; Interface: SPI,Serial; Number of DAC Channels: 1; Supply Voltage: 5V; Min Supply Voltage: 2.7V; Max Supply Voltage: 5.5V; Settling Time: 4.5us; Number of Bits: 12; Resolution: 12b; Supply Type: Single; Integral Nonlinearity (INL): 12LSB; Input Offset Voltage (Vos): 820uV; Nominal Supply Current: 175uA; Supplier 1: Digi-Key; Manufacturer Part Number: MCP4921T-E/MS; Stock 1: 5999; Pricing 1: 1=2.07, 25=1.722, 100=1.5645 (USD); Mount: Surface Mount; Case/Package: MSOP; Number of Pins: 8; Min Operating Temperature: -40°C; Max Operating Temperature: 125°C; Packaging: Tape and Reel; Number of Channels: 1; Package Quantity: 1; Number of Converters: 1; Radiation Hardening: No; REACH SVHC: No SVHC; Lead Free: Lead Free; ComponentLink1URL: https://datasheet.ciiva.com/3041/22248a-3041510.pdf; ComponentLink1Description: https://datasheet.ciiva.com/3041/22248a-3041510.pdf; ComponentLink2URL: https://datasheet.ciiva.com/6666/22248a-6666553.pdf; ComponentLink2Description: https://datasheet.ciiva.com/6666/22248a-6666553.pdf; ComponentLink3URL: https://datasheet.ciiva.com/8035/22248a-8035052.pdf; ComponentLink3Description: https://datasheet.ciiva.com/8035/22248a-8035052.pdf; ComponentLink4URL: https://datasheet.ciiva.com/16625/22248a-16625692.pdf; ComponentLink4Description: https://datasheet.ciiva.com/16625/22248a-16625692.pdf; ComponentLink5URL: https://datasheet.ciiva.com/16203/filehandler-aspxddocname-en547911-16203277.pdf; ComponentLink5Description: https://datasheet.ciiva.com/16203/filehandler-aspxddocname-en547911-16203277.pdf; ComponentLink6URL: https://datasheet.ciiva.com/6666/22248a-6666558.pdf; ComponentLink6Description: https://datasheet.ciiva.com/6666/22248a-6666558.pdf; ComponentLink7URL: https://datasheet.ciiva.com/41459/001083287-da-01-en-ic-dac-12-w-spi-mcp4921t-e-ms-msop-8-mcp-41459046.pdf; ComponentLink7Description: https://datasheet.ciiva.com/41459/001083287-da-01-en-ic-dac-12-w-spi-mcp4921t-e-ms-msop-8-mcp-41459046.pdf; Supplier Part Number 1: MCP4921T-E/MSCT-ND
U9 = TMS5701224CPGEQQ1: as U9 on sheet Power_MCU; Supplier 1: Digi-Key; Manufacturer Part Number: TMS5701224CPGEQQ1; Stock 1: 113; Pricing 1: 1=22.12, 10=20.402, 100=17.4222, 500=15.8176 (USD); Case/Package: LQFP; Number of Pins: 144; Min Operating Temperature: -40°C; Max Operating Temperature: 125°C; Packaging: Tray; Number of Programmable I/O: 64; Max Frequency: 160MHz; Number of GPIO: 64; Core Architecture: ARM; Lead Free: Lead Free; ComponentLink1URL: http://www.ti.com/lit/pdf/spnu515; ComponentLink1Description: http://www.ti.com/lit/pdf/spnu515; ComponentLink2URL: http://www.ti.com/lit/gpn/tms570ls1224; ComponentLink2Description: http://www.ti.com/lit/gpn/tms570ls1224; ComponentLink3URL: http://www.ti.com/general/docs/lit/getliterature.tsp?genericPartNumber=TMS570LS1224&&fileType=pdf; ComponentLink3Description: http://www.ti.com/general/docs/lit/getliterature.tsp?genericPartNumber=TMS570LS1224&&fileType=pdf; Supplier Part Number 1: 296-47200-ND